# EAGLE board SparkFun_DataLogger_IoT_9DOF (EAGLE 9.6.2)
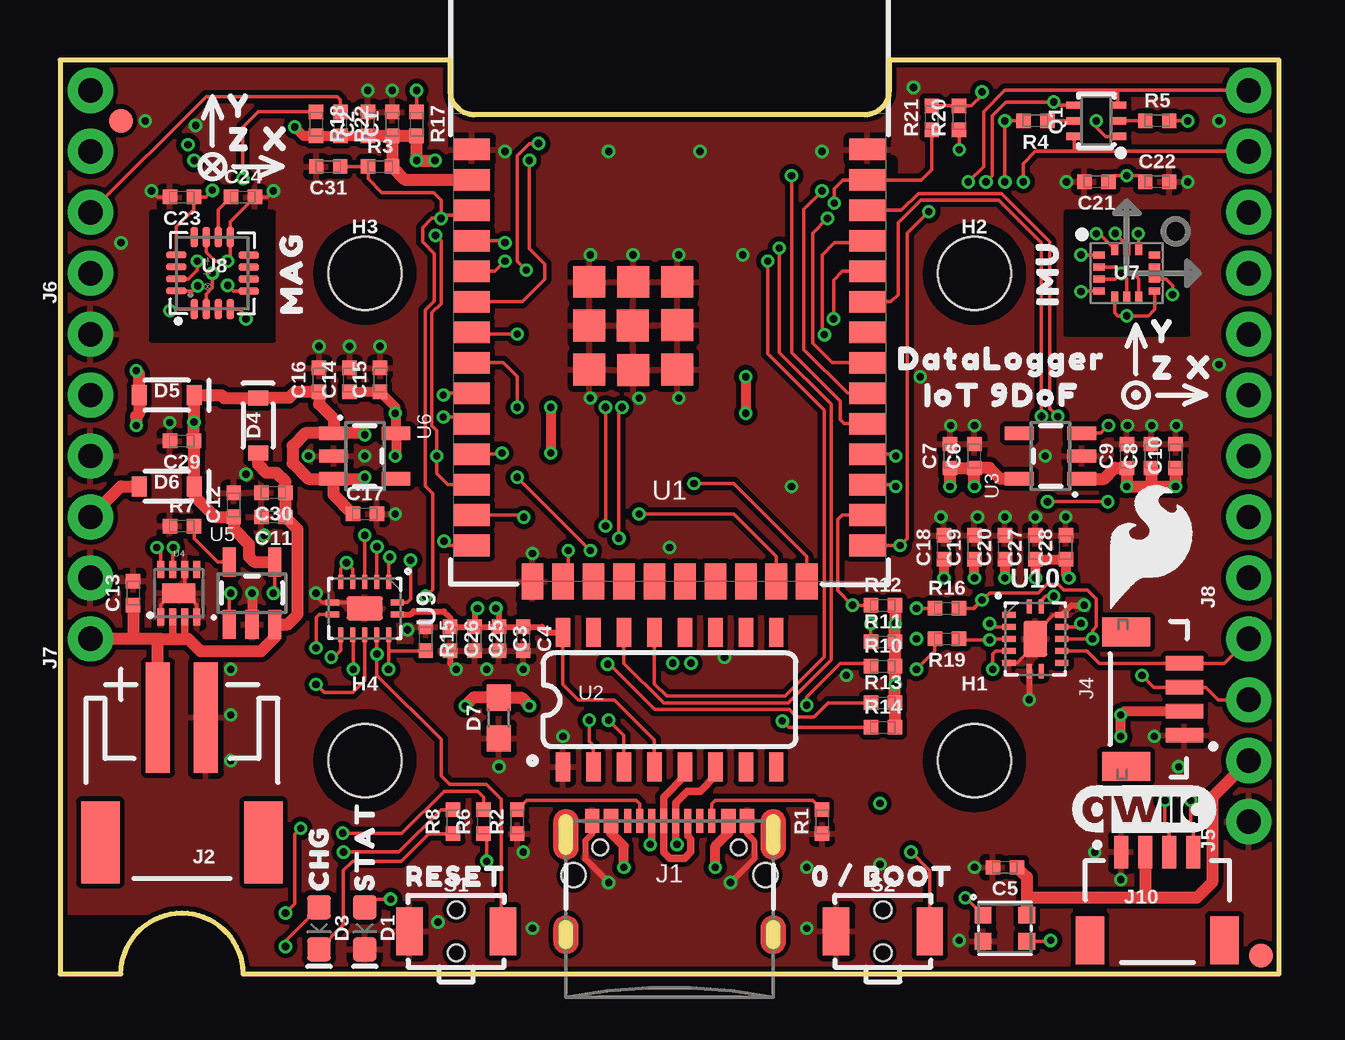
[diagram p1: board, top side]
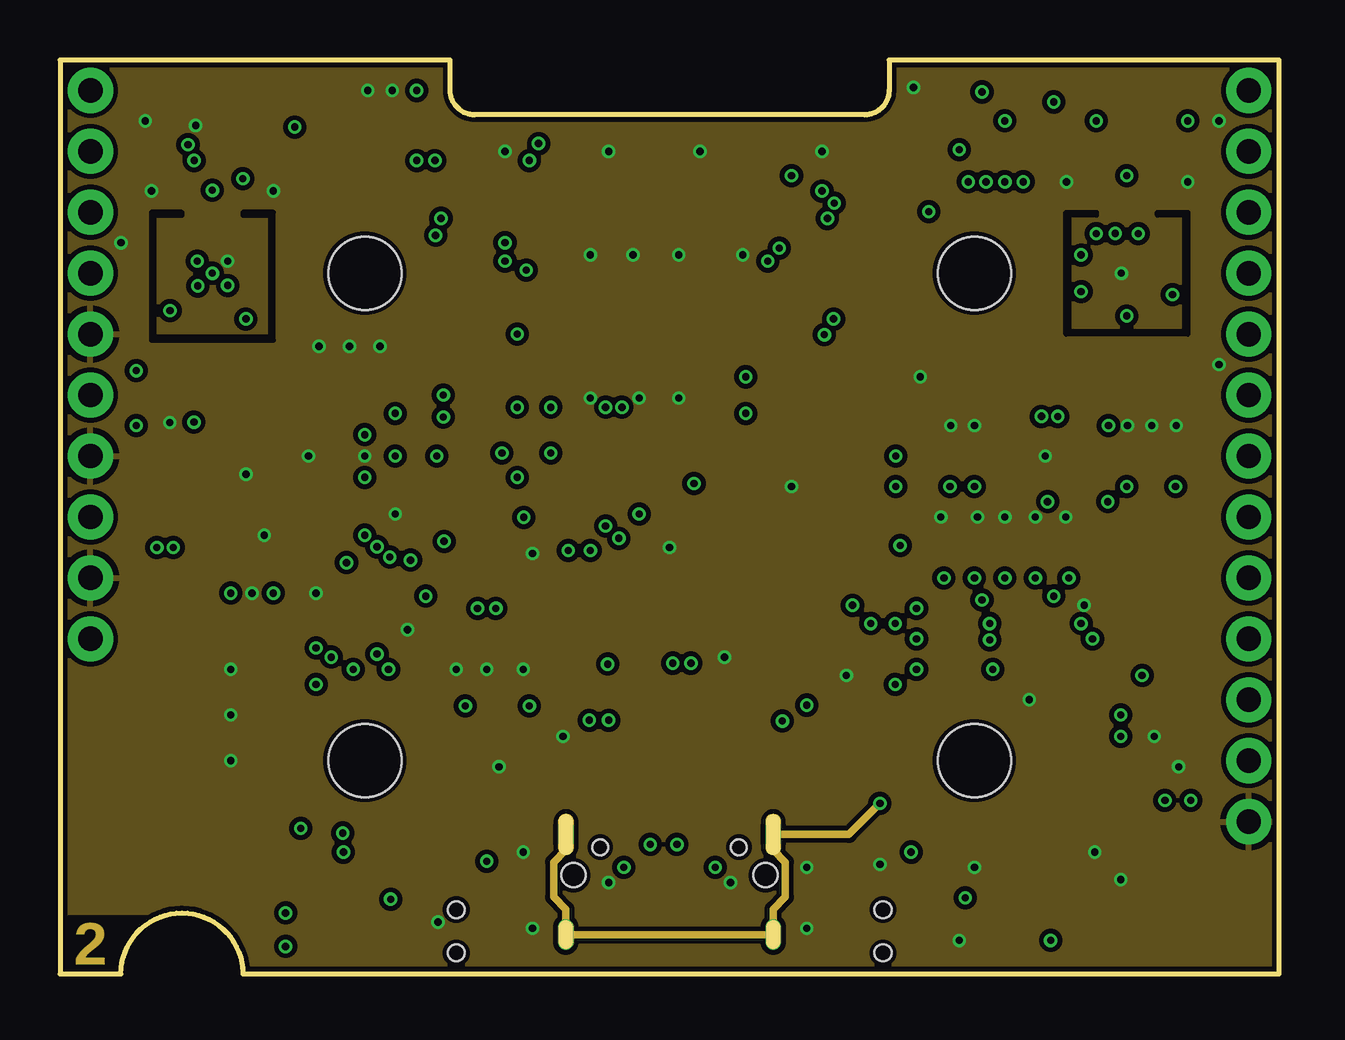
[diagram p2: board, inner layer Route2]
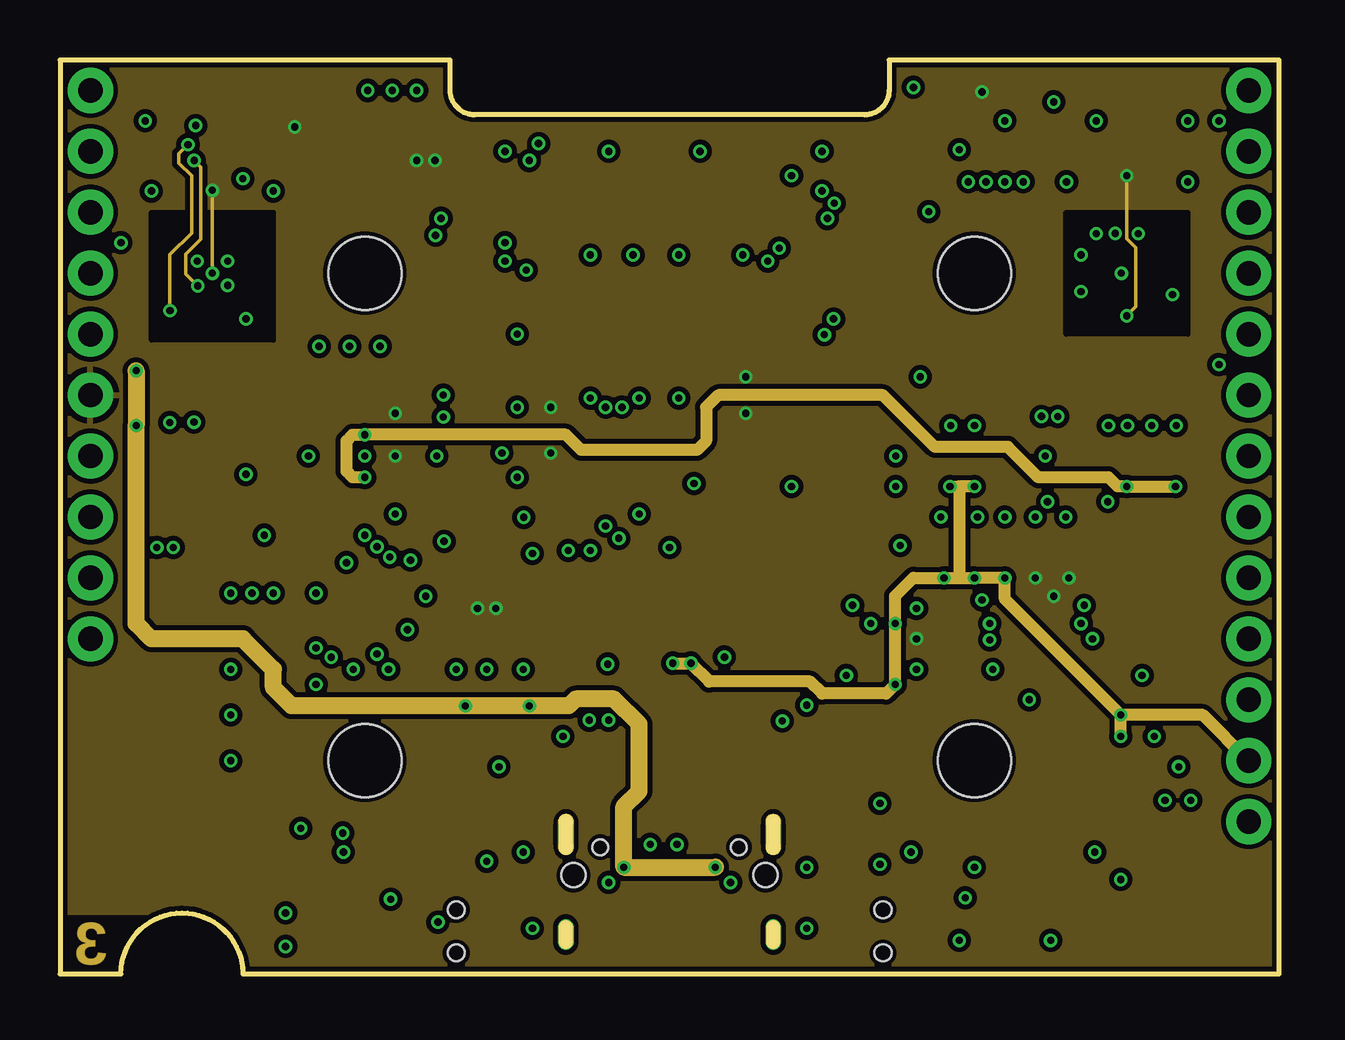
[diagram p3: board, inner layer Route15]
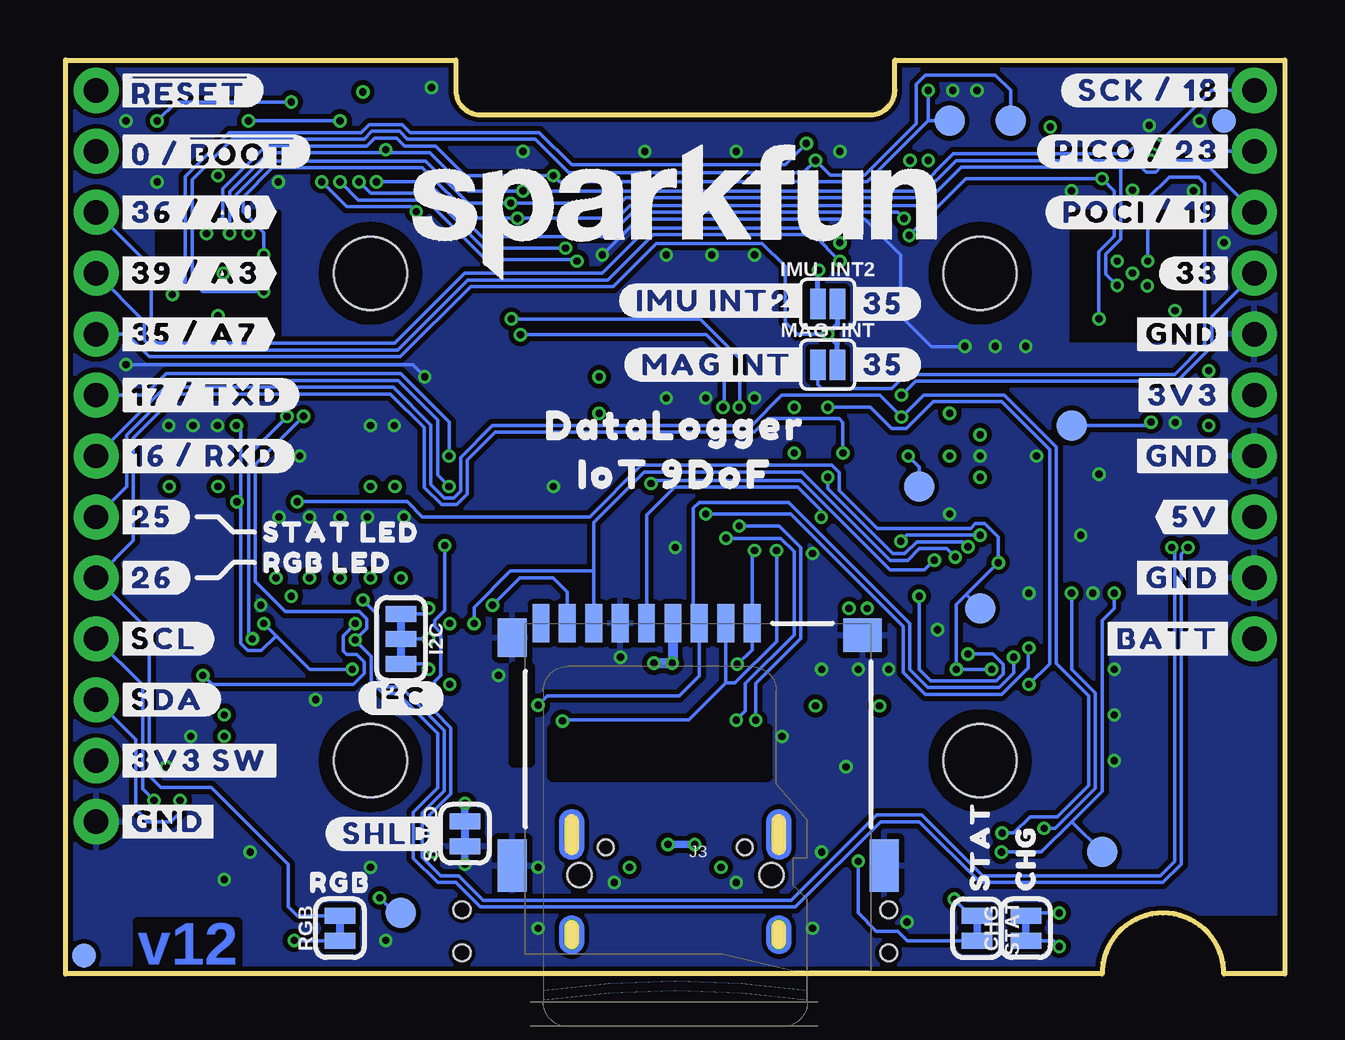
[diagram p4: board, bottom side, seen from below]

Size 50.8 x 38.1 mm. Coordinates in mm from the lower left corner, seen from the top.
Outline: 0,0 2.54,0 arc-90 5.08,2.54 arc-90 7.62,0 50.8,0 50.8,38.1 34.54,38.1 34.54,36.83 arc-90 33.53,35.81 17.27,35.81 arc-90 16.26,36.83 16.26,38.1 0,38.1 0,0
Copper layers (1*2*15*16): Top 0.035559375mm / dielectric 0.47751875mm / Route2 0.035559375mm / dielectric 0.47751875mm / Route15 0.035559375mm / dielectric 0.47751875mm / Bottom 0.035559375mm
Design rules "SparkFun-4-Layer-Minimum-JLCPCB": minimum track width 5mil, minimum drill 0.2mm, track to track 5mil, track to pad 5mil, pad to pad 5mil, via to via 5mil, smd to smd 5mil, copper to edge 7mil, drill to drill 7mil, minimum pad ring 5mil, minimum via ring 5mil, stop-mask expansion 2.5mil, vias tented up to drill 25mil, thermal gap 10mil
tRestrict: 2 lines

## Footprints (pad centres in the part's own frame; a part is rotated, then mirrored left to right if it is on the bottom)
0402-TIGHT = smd 0.6 x 0.6: 1 -0.5,0; 2 0.5,0
0402-TIGHT_NO_CREAM = smd 0.6 x 0.6: 1 -0.5,0; 2 0.5,0
SMT-JUMPER_2_NC_TRACE_SILK = smd 0.66 x 1.27: 1 -0.521,0; 2 0.521,0
LED-0603 = smd 1 x 1: A -0.877,0; C 0.877,0
WS2812-2020 = smd 0.7 x 0.7: DI -0.915,0.55; DO 0.915,-0.55; GND 0.915,0.55; VCC -0.915,-0.55
SOD-323 = smd 0.63 x 0.83: A 1.15,0; C -1.15,0
0603 = smd 1.1 x 1: 1 -0.85,0; 2 0.85,0
FIDUCIAL-1X2 = smd 1 x 1: 1 0,0
STAND-OFF-TIGHT = hole 3.048: 0,0
SMT-JUMPER_3_2-NC_TRACE_SILK = smd 0.66 x 1.27: 1 -1.041,0; 2 0,0; 3 1.041,0
PAD.03X.05 = smd 1.27 x 1.27: 1 0,0
SMT-JUMPER_2_NO_SILK = smd 0.635 x 1.27: 1 -0.406,0; 2 0.406,0
USB-C-16P_4LAYER-PADS = smd 0.3 x 1: A5 -1.25,-0.34; A6 -0.25,-0.34; A7 0.25,-0.34; A8 1.25,-0.34; B5 1.75,-0.34; B6 0.75,-0.34; B7 -0.75,-0.34; B8 -1.75,-0.34 | smd 0.6 x 1: GND -3.225,-0.34; GND2 3.225,-0.34; VBUS1 -2.45,-0.34; VBUS2 2.45,-0.34 | drill 0.4 pad 0.6 long: SHLD1 -4.318,-0.915; SHLD2 4.318,-0.915; SHLD3 -4.318,-5.095; SHLD4 4.318,-5.095 | hole 0.65: -2.89,-1.445; 2.89,-1.445
JST-2-SMD = smd 1 x 4.6: 1 -1,-3.7; 2 1,-3.7 | smd 1.6 x 3.4: NC1 -3.4,1.5; NC2 3.4,1.5
MICROSD-EXTERNALPIN = smd 0.7 x 1.6: 1 2.25,10.5; 2 1.15,10.5; 3 0.05,10.5; 4 -1.05,10.5; 5 -2.15,10.5; 6 -3.25,10.5; 7 -4.35,10.5; 8 -5.45,10.5; 9 -6.55,10.5 | smd 1.2 x 1.6: 10 -7.75,9.9 | smd 1.2 x 2.2: 11 -7.75,0.4; 12 7.75,0.4 | smd 1.6 x 1.4: 13 6.85,10 | hole 1: 3.05,0; -4.95,0
JST04_1MM_VERT = smd 0.6 x 1.55: 1 -1.478,0.775; 2 -0.478,0.775; 3 0.522,0.775; 4 1.522,0.775 | smd 1.2 x 2: NC1 -2.778,3.2; NC2 2.822,3.2
1X04_NO_SILK = drill 1.016 pad 1.88: 1 0,0; 2 2.54,0; 3 5.08,0; 4 7.62,0
1X06_NO_SILK = drill 1.016 pad 1.88: 1 0,0; 2 2.54,0; 3 5.08,0; 4 7.62,0; 5 10.16,0; 6 12.7,0
1X09_NO_SILK = drill 1.016 pad 1.88: 1 0,0; 2 2.54,0; 3 5.08,0; 4 7.62,0; 5 10.16,0; 6 12.7,0; 7 15.24,0; 8 17.78,0; 9 20.32,0
JST04_1MM_RA = smd 0.6 x 1.35: 1 -1.5,0; 2 -0.5,0; 3 0.5,0; 4 1.5,0 | smd 1.2 x 2: NC1 2.8,-3.675; NC2 -2.8,-3.675
SC70-6 = smd 0.3 x 0.66: 1 -0.65,-0.92; 2 0,-0.92; 3 0.65,-0.92; 4 0.65,0.92; 5 0,0.92; 6 -0.65,0.92
TACTILE_SWITCH_SMD_RIGHT_ANGLE = smd 1.1 x 2: 1 -1.95,0; 2 1.95,0 | hole 0.7: 0,0.9; 0,-0.9
ESP-WROOM-32D-NARROW = smd 0.9 x 1.5: 1 6.43,8.238; 2 5.16,8.238; 3 3.89,8.238; 4 2.62,8.238; 5 1.35,8.238; 6 0.08,8.238; 7 -1.19,8.238; 8 -2.46,8.238; 9 -3.73,8.238; 10 -5,8.238; 11 -6.27,8.238; 12 -7.54,8.238; 13 -8.81,8.238; 14 -10.08,8.238; 25 -10.08,-8.238; 26 -8.81,-8.238; 27 -7.54,-8.238; 28 -6.27,-8.238; 29 -5,-8.238; 30 -3.73,-8.238; 31 -2.46,-8.238; 32 -1.19,-8.238; 33 0.08,-8.238; 34 1.35,-8.238; 35 2.62,-8.238; 36 3.89,-8.238; 37 5.16,-8.238; 38 6.43,-8.238 | smd 1.5 x 0.9: 15 -11.57,5.715; 16 -11.57,4.445; 17 -11.57,3.175; 18 -11.57,1.905; 19 -11.57,0.635; 20 -11.57,-0.635; 21 -11.57,-1.905; 22 -11.57,-3.175; 23 -11.57,-4.445; 24 -11.57,-5.715 | smd 1.33 x 1.33: GND1 -0.912,1.531; GNDT1 -2.751,3.346; GNDT2 -2.761,1.516; GNDT3 -2.751,-0.314; GNDT4 -0.891,-0.324; GNDT5 0.909,-0.314; GNDT6 0.909,1.516; GNDT7 0.909,3.346; GNDT8 -0.921,3.346
SO016 = smd 0.6 x 1.2: 1 -4.445,-2.8; 2 -3.175,-2.8; 3 -1.905,-2.8; 4 -0.635,-2.8; 5 0.635,-2.8; 6 1.905,-2.8; 7 3.175,-2.8; 8 4.445,-2.8; 9 4.445,2.8; 10 3.175,2.8; 11 1.905,2.8; 12 0.635,2.8; 13 -0.635,2.8; 14 -1.905,2.8; 15 -3.175,2.8; 16 -4.445,2.8
SOT23-5 = smd 0.55 x 1.2: 1 -0.95,-1.3; 2 0,-1.3; 3 0.95,-1.3; 4 0.95,1.3; 5 -0.95,1.3
DFN-8 = smd 0.3 x 0.7: 1 -0.75,-0.99; 2 -0.25,-0.99; 3 0.25,-0.99; 4 0.75,-0.99; 5 0.75,0.99; 6 0.25,0.99; 7 -0.25,0.99; 8 -0.75,0.99 | smd 1.38 x 0.8: 9 0,0
LGA-14L = smd 0.48 x 0.3: P1 -1.163,0.75; P2 -1.163,0.25; P3 -1.163,-0.25; P4 -1.163,-0.75; P8 1.163,-0.75; P9 1.163,-0.25; P10 1.163,0.25; P11 1.163,0.75 | smd 0.3 x 0.48: P5 -0.5,-1; P6 0,-1; P7 0.5,-1; P12 0.5,1; P13 0,1; P14 -0.5,1
LGA-16-3X3MM-4X4PINS = smd 0.3 x 0.85: 1 0.754,1.498; 2 0.254,1.498; 3 -0.246,1.498; 4 -0.746,1.498; 9 -0.746,-1.506; 10 -0.246,-1.506; 11 0.254,-1.506; 12 0.754,-1.506 | smd 0.85 x 0.3: 5 -1.508,0.746; 6 -1.508,0.246; 7 -1.508,-0.254; 8 -1.508,-0.754; 13 1.496,-0.764; 14 1.496,-0.264; 15 1.496,0.236; 16 1.496,0.736
14-QFN = smd 0.25 x 0.6: 1 -0.25,1.35; 7 -0.25,-1.35; 8 0.25,-1.35; 14 0.25,1.35 | smd 0.6 x 0.25: 2 -1.1,1; 3 -1.1,0.5; 4 -1.1,0; 5 -1.1,-0.5; 6 -1.1,-1; 9 1.1,-1; 10 1.1,-0.5; 11 1.1,0; 12 1.1,0.5; 13 1.1,1 | smd 1 x 1.5: EPAD 0,0

## Placement (x,y rotation side)
C1  2.2uF  [0402-TIGHT]  13.84,35.43 90 top
C2  0.1uF  [0402-TIGHT]  12.83,35.43 90 top
C3  2.2uF  [0402-TIGHT]  18.29,13.97 270 top
C4  10nF  [0402-TIGHT]  19.3,13.97 270 top
C5  2.2uF  [0402-TIGHT]  39.37,4.45 180 top
C6  2.2uF  [0402-TIGHT]  38.1,21.59 90 top
C7  0.1uF  [0402-TIGHT]  37.08,21.59 90 top
C8  2.2uF  [0402-TIGHT]  45.47,21.59 90 top
C9  2.2uF  [0402-TIGHT]  44.45,21.59 90 top
C10  2.2uF  [0402-TIGHT]  46.48,21.59 90 top
C11  2.2uF  [0402-TIGHT]  8.89,19.05 180 top
C12  2.2uF  [0402-TIGHT]  7.24,19.56 90 top
C13  0.1uF  [0402-TIGHT]  3.05,15.88 90 top
C14  2.2uF  [0402-TIGHT]  12.06,24.77 90 top
C15  0.1uF  [0402-TIGHT]  13.34,24.77 90 top
C16  2.2uF  [0402-TIGHT]  10.79,24.77 90 top
C17  0.1uF  [0402-TIGHT]  12.7,19.18 0 top
C18  2.2uF  [0402-TIGHT]  36.83,17.78 90 top
C19  0.1uF  [0402-TIGHT]  38.1,17.78 90 top
C20  2.2uF  [0402-TIGHT]  39.37,17.78 90 top
C21  0.1uF  [0402-TIGHT]  43.18,33.02 180 top
C22  0.1uF  [0402-TIGHT]  45.72,33.02 0 top
C23  2.2uF  [0402-TIGHT]  5.08,32.38 180 top
C24  10uF  [0402-TIGHT]  7.62,32.38 0 top
C25  2.2uF  [0402-TIGHT]  17.27,13.97 270 top
C26  2.2uF  [0402-TIGHT]  16.26,13.97 270 top
C27  2.2uF  [0402-TIGHT]  40.64,17.78 90 top
C28  2.2uF  [0402-TIGHT]  41.91,17.78 90 top
C29  2.2uF  [0402-TIGHT]  5.08,22.23 180 top
C30  2.2uF  [0402-TIGHT]  8.89,20.07 180 top
C31  DNP  [0402-TIGHT_NO_CREAM]  11.18,33.66 180 top
CHG  JUMPER-SMT_2_NC_TRACE_SILK  [SMT-JUMPER_2_NC_TRACE_SILK]  10.79,1.91 90 bottom
D1  BLUE  [LED-0603]  12.7,1.91 270 top
D2  WS2812_2020  [WS2812-2020]  39.37,1.91 180 top
D3  Yellow  [LED-0603]  10.79,1.91 270 top
D4  3A/10V/280mV  [SOD-323]  8.26,22.86 270 top
D5  3A/10V/280mV  [SOD-323]  4.45,24.13 180 top
D6  3A/10V/280mV  [SOD-323]  4.45,20.32 180 top
D7  TVS  [0603]  18.29,10.67 90 top
FD1  FIDUCIAL1X2  [FIDUCIAL-1X2]  2.54,35.56 0 bottom
FD2  FIDUCIAL1X2  [FIDUCIAL-1X2]  2.54,35.56 0 top
FD3  FIDUCIAL1X2  [FIDUCIAL-1X2]  50.04,0.76 0 bottom
FD4  FIDUCIAL1X2  [FIDUCIAL-1X2]  50.04,0.76 0 top
FRAME1  FRAME-LEDGER  [CREATIVE_COMMONS]  88.9,-5.08 0 top  (outside the outline)
H1  STAND-OFFTIGHT  [STAND-OFF-TIGHT]  38.1,8.89 0 top
H2  STAND-OFFTIGHT  [STAND-OFF-TIGHT]  38.1,29.21 0 top
H3  STAND-OFFTIGHT  [STAND-OFF-TIGHT]  12.7,29.21 0 top
H4  STAND-OFFTIGHT  [STAND-OFF-TIGHT]  12.7,8.89 0 top
I2C  JUMPER-SMT_3_2-NC_TRACE_SILK  [SMT-JUMPER_3_2-NC_TRACE_SILK]  36.83,13.97 270 bottom
IMU_!CS!  TEST-POINT3X5  [PAD.03X.05]  13.97,35.56 0 bottom
IMU_INT1  TEST-POINT3X5  [PAD.03X.05]  11.43,35.56 0 bottom
IMU_INT2  JUMPER-SMT_2_NO_SILK  [SMT-JUMPER_2_NO_SILK]  19.05,27.94 0 bottom
J1  [USB-C-16P_4LAYER-PADS]  25.4,6.73 0 top
J2  [JST-2-SMD]  5.08,6.99 180 top
J3  MICRO-SD-PUSH-PUSH-EXT-PIN  [MICROSD-EXTERNALPIN]  24.45,4.11 0 bottom
J4  Vertical Qwiic Connector  [JST04_1MM_VERT]  47.62,11.43 90 top
J5  [1X04_NO_SILK]  49.53,6.35 90 top
J6  [1X04_NO_SILK]  1.27,29.21 90 top
J7  [1X06_NO_SILK]  1.27,13.97 90 top
J8  [1X09_NO_SILK]  49.53,16.51 90 top
J10  QWIIC_RIGHT_ANGLE  [JST04_1MM_RA]  45.72,5.08 0 top
LOGO1  SPECIAL_INSTRUCTIONS-ORDERING  [ORDERING_INSTRUCTIONS]  62.23,54.61 0 top  (outside the outline)
LOGO3  QWIIC_LOGO_6MM  [QWIIC_6MM]  45.21,6.86 0 top
LOGO5  SFE_LOGO_NAME.2_INCH  [SFE_LOGO_NAME_.2]  25.4,31.75 0 bottom
LOGO6  SFE_LOGO_FLAME.2_INCH  [SFE_LOGO_FLAME_.2]  45.47,17.78 0 top
MAG_!CS!  TEST-POINT3X5  [PAD.03X.05]  15.24,20.32 0 bottom
MAG_INT  JUMPER-SMT_2_NO_SILK  [SMT-JUMPER_2_NO_SILK]  19.05,25.4 0 bottom
PWREN  TEST-POINT3X5  [PAD.03X.05]  12.7,15.24 0 bottom
Q1  [SC70-6]  43.18,35.56 90 top
R1  5.1k  [0402-TIGHT]  31.75,6.35 90 top
R2  5.1k  [0402-TIGHT]  19.05,6.35 90 top
R3  10k  [0402-TIGHT]  13.34,33.66 0 top
R4  10k  [0402-TIGHT]  40.64,35.56 180 top
R5  10k  [0402-TIGHT]  45.72,35.56 0 top
R6  1k  [0402-TIGHT]  17.65,6.35 90 top
R7  2.0K  [0402-TIGHT]  5.08,18.67 0 top
R8  1k  [0402-TIGHT]  16.38,6.35 90 top
R10  10k  [0402-TIGHT]  34.29,12.83 0 top
R11  10k  [0402-TIGHT]  34.29,13.84 0 top
R12  10k  [0402-TIGHT]  34.29,15.37 0 top
R13  10k  [0402-TIGHT]  34.29,11.3 0 top
R14  10k  [0402-TIGHT]  34.29,10.29 0 top
R15  100k  [0402-TIGHT]  15.24,13.97 270 top
R16  2.2k  [0402-TIGHT]  36.96,15.24 0 top
R17  100k  [0402-TIGHT]  14.86,35.43 270 top
R18  100k  [0402-TIGHT]  10.67,35.43 270 top
R19  2.2k  [0402-TIGHT]  36.96,13.97 180 top
R20  100k  [0402-TIGHT]  37.47,35.69 90 top
R21  100k  [0402-TIGHT]  36.32,35.69 90 top
R22  10k  [0402-TIGHT]  11.68,35.43 270 top
RGB  JUMPER-SMT_2_NC_TRACE_SILK  [SMT-JUMPER_2_NC_TRACE_SILK]  39.37,1.91 90 bottom
S1  RESET  [TACTILE_SWITCH_SMD_RIGHT_ANGLE]  16.51,1.78 0 top
S2  BOOT  [TACTILE_SWITCH_SMD_RIGHT_ANGLE]  34.29,1.78 0 top
SHLD  JUMPER-SMT_2_NC_TRACE_SILK  [SMT-JUMPER_2_NC_TRACE_SILK]  34.16,5.84 90 bottom
STAT  JUMPER-SMT_2_NC_TRACE_SILK  [SMT-JUMPER_2_NC_TRACE_SILK]  12.83,1.91 270 bottom
TP1  TEST-POINT3X5  [PAD.03X.05]  36.83,2.54 180 bottom
U1  ESP-WROOM-32E  [ESP-WROOM-32D-NARROW]  25.4,27.94 90 top
U2  CH340C  [SO016]  25.4,11.43 0 top
U3  3.3V  [SOT23-5]  41.27,21.59 90 top
U4  MAX17048  [DFN-8]  4.95,15.88 0 top
U5  MCP73831  [SOT23-5]  8,15.88 0 top
U6  3.3V  [SOT23-5]  12.7,21.59 270 top
U7  ISM330DHCX  [LGA-14L]  44.45,29.21 0 top
U8  MMC5983MA_QFN16  [LGA-16-3X3MM-4X4PINS]  6.35,29.21 180 top
U9  74HC4066_QUAD_BILATERAL_SWITCH_QFN  [14-QFN]  12.7,15.24 270 top
U10  74HC4066_QUAD_BILATERAL_SWITCH_QFN  [14-QFN]  40.64,13.97 0 top
U$1  [IOT_9DOF0]  39.24,24.13 0 top
U$2  [RESET0]  16.51,4.06 0 top
U$3  [STAT0]  12.7,5.33 90 top
U$4  [CHG0]  10.79,4.83 90 top
U$5  [CHG0]  10.79,4.83 90 bottom
U$6  [STAT0]  12.7,5.33 90 bottom
U$7  [0_#_BOOT0]  34.29,4.06 0 top
U$8  [IMU0]  41.15,29.21 90 top
U$9  [MAG0]  9.65,29.21 90 top
U$10  [X0]  9.02,34.8 0 top
U$11  [Y0]  7.49,36.2 0 top
U$12  [Z0]  7.49,34.8 0 top
U$13  [X0]  47.5,25.27 0 top
U$14  [Y0]  45.97,26.8 0 top
U$15  [Z0]  45.97,25.27 0 top
U$16  [##RESET##0]  48.77,36.83 0 bottom
U$17  [#0_#_#BOOT##0]  48.77,34.29 0 bottom
U$18  [#36_#_A0#0]  48.77,31.75 0 bottom
U$19  [#39_#_A3#0]  48.77,29.21 0 bottom
U$20  [#35_#_A7#0]  48.77,26.67 0 bottom
U$21  [#17_#_TXD#0]  48.77,24.13 0 bottom
U$22  [#16_#_RXD#0]  48.77,21.59 0 bottom
U$23  [#25#0]  48.77,19.05 0 bottom
U$24  [#26#0]  48.77,16.51 0 bottom
U$25  [#SCL#0]  48.77,13.97 0 bottom
U$26  [#SDA#0]  48.77,11.43 0 bottom
U$27  [#3V3_SW#0]  48.77,8.89 0 bottom
U$28  [#GND#0]  48.77,6.35 0 bottom
U$29  [#GND#1]  2.03,16.51 0 bottom
U$30  [#GND#1]  2.03,21.59 0 bottom
U$31  [#GND#1]  2.03,26.67 0 bottom
U$32  [#BATT#0]  2.03,13.97 0 bottom
U$33  [#5V#0]  2.03,19.05 0 bottom
U$34  [#3V3#0]  2.03,24.13 0 bottom
U$35  [#33#0]  2.03,29.21 0 bottom
U$36  [#POCI_#_19#0]  2.03,31.75 0 bottom
U$37  [#PICO_#_23#0]  2.03,34.29 0 bottom
U$38  [#SCK_#_18#0]  2.03,36.83 0 bottom
U$40  [#IMU_INT2#0]  19.81,28.07 0 bottom
U$41  [#MAG_INT#0]  19.81,25.4 0 bottom
U$42  [#35#0]  18.29,27.94 0 bottom
U$43  [#35#0]  18.29,25.4 0 bottom
U$44  [IOT_9DOF10]  25.4,20.83 0 bottom
U$45  [#SHLD#0]  34.8,5.84 0 bottom
U$46  [#I�C#0]  36.83,11.49 0 bottom
U$47  [STAT_LED0]  43.18,18.41 0 bottom
U$48  [RGB_LED0]  43.18,17.14 0 bottom
U$49  [RGB0]  39.37,3.81 0 bottom
U$50  [DATALOGGER0]  39.24,25.65 0 top
U$51  [DATALOGGER1]  25.4,22.86 0 bottom
VIN  TEST-POINT3X5  [PAD.03X.05]  8.89,22.86 0 bottom
VIN1  TEST-POINT3X5  [PAD.03X.05]  7.62,5.08 0 bottom

## Tracks (layer width: path | path; a pad name or v marks a point on that pad's centre or on a via)
3.3V  (via drill 0.3)
  Top 0.152: C21.1 43.93,33.27 v44.45,33.27 44.97,33.27 C22.1 | U7.P5 43.94,27.56 44.07,27.43 v44.45,27.43 45.34,27.43 45.61,27.71 U7.P8 | v6.35,32.67 6.07,32.38 C23.1 5.58,31.87 4.85,31.14 U8.13 | v6.35,29.21 6.35,28.6 6.1,28.35 U8.2 | U10.14 40.89,15.57 41.06,15.75 v41.4,15.75 | U2.4 24.77,9.75 23.09,11.43 21.59,11.43 20.95,12.06 U2.16 | v38.42,36.77 38.42,36.64 37.97,36.19 R20.2 R21.2
  Top 0.254: U9.14 14.61,14.99 14.73,15.11 15.99,15.11 16.26,14.85 C26.1 C25.1 | v17.4,15.24 17.27,15.11 C25.1 | C25.1 C3.1 | U2.16 20.31,14.23 20.07,14.47 C4.1 C3.1 | v18.16,15.24 18.29,15.11 C3.1
  Top 0.406: v13.97,21.59 14,21.62 U6.5 14,23.34 v13.97,23.37 13.97,23.63 C15.1 C14.1 | v42.04,16.51 v42.04,16.52 41.91,16.64 C28.1 C27.1 v40.64,16.51 | v20.45,23.62 v20.45,21.72 | v28.57,24.89 v28.57,23.37 | C2.1 R22.2 R18.2 10.15,34.93 v9.78,35.31 | R3.2
  Top 0.508: C1.1 C2.1 | U1.2 14.39,33.1 R3.2 | C1.1 R3.2 | C1.1 R17.2 v14.86,33.91 v15.62,33.91
  Route15 0.152: v6.35,32.67 v6.35,29.21 | v44.45,33.27 44.45,30.66 44.83,30.28 44.83,27.81 v44.45,27.43
  Bottom 0.152: I2C.2 v35.69,13.97
  pour Route15 (isolate 0.203): 3.81,0 3.81,2.54 0,2.54 0,38.1 16.26,38.1 16.26,35.81 34.54,35.81 34.54,38.1 50.8,38.1 50.8,0
  cutout Route15: 3.81,26.42 3.81,31.75 8.89,31.75 8.89,26.42
  cutout Route15: 41.91,26.67 41.91,31.75 46.99,31.75 46.99,26.67
3.3V_SW  (via drill 0.3)
  Top 0.406: C18.1 v36.83,16.51 | v38.1,16.51 C19.1 | C20.1 v39.37,16.51 | 34.79,14.6 v34.8,14.61 | 34.79,12.07 v34.8,12.06 | J4.2 44.35,10.95 v44.2,10.79 v44.2,9.91 | 45.22,3.18 45.21,3.17
  Top 0.508: 34.79,14.6 R11.2 R10.2 34.79,12.07 R13.2 R14.2 | R12.2 v34.8,14.61 | J5.2 48.01,7.37 48.01,3.81 47.37,3.17 45.21,3.17 40.28,3.17 | C6.1 C7.1 v37.08,20.32 | v38.1,20.32 C6.1 | U3.5 39.18,20.64 38.73,21.09 C6.1 | J10.2 45.22,3.18 | 40.28,3.17 D2.VCC | C5.1 40.28,4.03 40.28,3.17
  Route15 0.508: 37.47,16.51 v36.83,16.51 35.56,16.51 34.8,15.75 v34.8,14.61 v34.8,12.06 34.42,11.68 31.75,11.68 31.24,12.19 27.05,12.19 v26.29,12.95 v25.53,12.95 | 37.47,16.51 v38.1,16.51 v39.37,16.51 39.37,15.62 v44.2,10.79 | J5.2 47.62,10.79 v44.2,10.79 | v37.08,20.32 37.47,20.32 | 37.47,20.32 37.47,16.51 | v38.1,20.32 37.47,20.32 | v44.2,9.91 v44.2,10.79
  Bottom 0.406: J3.4 25.5,12.98 v25.53,12.95 v26.29,12.95
5V
  Top 0.508: J7.3 2.54,20.32 D6.A
!RESET!  (via drill 0.3)
  Top 0.152: U9.12 v13.2,13.34 v13.21,13.34 13.21,12.45 15.88,9.78 15.88,8.26 16.23,7.9 17.75,7.9 18.39,7.27 18.39,1.85 S1.2 | v37.85,33.02 38.48,33.66 38.48,35.94 39.37,36.83 44.07,36.83 | 44.07,36.83 J8.9 | Q1.3 44.07,36.24 44.07,36.83 | U1.3 16.95,31.62 16,31.62 v15.88,31.5 | v15.24,15.75 15.52,16.03 15.52,20.02 15.21,20.33 15.21,27.68 15.6,28.06 15.6,30.04 15.11,30.52 15.11,31.11 15.49,31.5 v15.88,31.5 | v15.88,31.5 15.88,32.26 15.57,32.57 13.41,32.57 12.84,33.15 R3.1 C31.1
  Bottom 0.152: v37.85,33.02 35.74,33.02 33.46,30.73 28.19,30.73 27.18,31.75 16.13,31.75 v15.88,31.5 | v13.21,13.34 12.18,13.34 11.74,12.9 11.74,12.5 12.02,12.22 14.76,12.22 15.24,12.7 v15.24,15.75
CAP
  Top 0.152: U8.10 6.6,31.87 C24.1
CH340-DTR  (via drill 0.3)
  Top 0.152: R4.2 v39.37,35.56 v39.37,33.02 | Q1.1 43.58,34.91 43.18,35.31 v43.18,35.56 | U2.13 24.77,12.09 25.27,11.58 30.23,11.58 31.85,13.21 31.85,23.51 29.49,25.87 v29.49,29.72
  Bottom 0.152: v39.37,35.56 v43.18,35.56 | v29.49,29.72 29.55,29.77 33.29,29.77 35.77,32.26 38.61,32.26 v39.37,33.02
CH340-RTS  (via drill 0.3)
  Top 0.152: R5.2 v46.99,35.56 | Q1.4 41.62,36.21 41.48,36.35 v41.4,36.35 39.41,36.35 38.83,35.77 38.83,33.27 v38.58,33.02 | v29.97,30.25 29.97,25.91 32.13,23.75 32.13,13.08 30.35,11.3 25.15,11.3 23.5,12.95 U2.14
  Bottom 0.152: v46.99,35.56 46.2,36.35 v41.4,36.35 | v38.58,33.02 38.1,32.54 35.66,32.54 33.37,30.25 v29.97,30.25
CH340-RX  (via drill 0.3)
  Top 0.152: U1.35 33.56,30.48 32.26,30.48 31.75,29.97 31.75,26.75 v31.85,26.65 | v22.86,10.58 23.5,9.94 U2.3 | v23.41,23.62 23.29,23.5 v23.29,18.16
  Bottom 0.152: v31.85,26.65 24.11,26.65 23.37,25.91 23.37,23.67 v23.41,23.62 | v23.29,18.16 21,18.16 20.45,17.61 20.45,14.13 22.48,12.1 22.48,10.96 v22.86,10.58
CH340-TX  (via drill 0.3)
  Top 0.152: U1.34 32.59,29.29 32.23,28.93 v32.23,27.3 | v22.05,10.58 22.05,9.69 22.23,9.52 U2.2 | v22.73,23.62 v22.73,18.67
  Bottom 0.152: v32.23,27.3 24.37,27.3 22.71,25.64 22.71,23.65 v22.73,23.62 | v22.05,10.58 22.05,12.1 20.17,13.98 20.17,17.77 21.07,18.67 v22.73,18.67
D+
  Top 0.305: U2.5 26.04,8.26 25.15,7.37 J1.A6 25.15,5.08 25.4,4.83 26.04,4.83 26.29,5.08 26.29,5.62 26.15,5.76 J1.B6
D-  (via drill 0.3)
  Top 0.305: U2.6 27.3,8.26 26.67,7.62 26.14,7.62 25.65,7.13 J1.A7 25.65,5.4 v25.71,5.4 | J1.B7 24.65,5.5 24.59,5.45 v24.59,5.4
  Bottom 0.305: v25.71,5.4 v24.59,5.4
ESP0/!BOOT!  (via drill 0.3)
  Top 0.152: J8.8 42.29,34.29 | Q1.6 42.26,34.32 42.29,34.29 | v40.13,33.02 40.13,33.78 40.64,34.29 42.29,34.29 | U1.25 v35.01,17.86 35.31,18.16 35.31,30.89 v36.2,31.78 | S2.2 36.24,4.3 v35.46,5.08
  Bottom 0.152: v40.13,33.02 39.09,31.98 36.4,31.98 v36.2,31.78 | v35.46,5.08 35.66,5.28 35.66,6.6 34.75,7.52 34.75,10.26 35.43,10.95 35.43,12.19 35.18,12.45 35.18,14.22 35.43,14.48 35.43,14.73 35.01,15.16 v35.01,17.86
ESP2/DAT0  (via drill 0.3)
  Top 0.152: U9.1 14.47,15.49 14.61,15.62 v14.61,17.25 | U1.24 31.11,17.4 28.07,20.45 v26.42,20.45
  Bottom 0.152: v26.42,20.45 26.29,20.57 20.18,20.57 16.44,16.84 15.02,16.84 v14.61,17.25
ESP4/DAT1  (via drill 0.3)
  Top 0.152: U1.26 32.59,19.13 32.41,18.95 32.41,15.98 v33.02,15.37 R12.1
  Bottom 0.152: J3.8 29.9,15.93 30.48,16.51 31.88,16.51 v33.02,15.37
ESP5/!IMU_CS!  (via drill 0.3)
  Top 0.152: U7.P12 44.95,30.84 v44.93,30.86 | v30.48,33.27 30.48,25.91 32.51,23.88 32.51,23.11 32.69,22.94 U1.29 | R17.1 v14.86,36.83
  Bottom 0.152: v44.93,30.86 44.25,31.54 44.25,32.73 42.46,34.52 38.26,34.52 37.93,34.84 37,34.84 36.67,34.52 35.39,34.52 34.15,33.27 v30.48,33.27 30.23,33.02 17.4,33.02 14.86,35.56 | 14.86,35.56 v14.86,36.83 | IMU_!CS!.1 14.86,35.56
ESP12/DAT2  (via drill 0.3)
  Top 0.152: U9.4 v12.7,18.29 | v16,18.03 16.18,17.86 U1.14
  Bottom 0.152: v16,18.03 15.75,18.29 v12.7,18.29
ESP13/DAT3  (via drill 0.3)
  Top 0.152: U1.16 21.18,16.6 v21.18,17.65 | R14.1 30.36,10.29 v30.1,10.54
  Bottom 0.152: J3.2 23.3,12.14 | v21.18,17.65 21.18,13.87 22.92,12.14 23.3,12.14 | v30.1,10.54 30.05,10.6 24.84,10.6 23.3,12.14
ESP14/CLK  (via drill 0.3)
  Top 0.152: U1.13 19.22,19.13 v19.32,19.04
  Bottom 0.152: v19.32,19.04 19.32,19.32 20.3,20.3 25.43,20.3 26.6,19.12 J3.5
ESP15/CMD  (via drill 0.3)
  Top 0.152: U9.8 10.8,14.99 10.67,14.86 v10.67,13.59 | v24.13,19.18 28.07,19.18 29.84,17.4 U1.23
  Bottom 0.152: v10.67,13.59 10.7,13.56 10.7,12.76 11.79,11.66 14.99,11.66 15.9,12.57 15.9,14.49 20.59,19.18 v24.13,19.18
ESP16/RXD  (via drill 0.3)
  Top 0.152: U1.27 34.75,20.4 v34.83,20.32
  Bottom 0.152: v34.83,20.32 35.31,20.8 35.31,23.1 36.95,24.74 46.38,24.74 J8.3
ESP17/TXD  (via drill 0.3)
  Top 0.152: U1.28 34.75,21.67 v34.83,21.59
  Bottom 0.152: v34.83,21.59 34.83,23.02 36.83,25.02 46.61,25.02 47.5,24.13 J8.4
ESP18/SCK  (via drill 0.3)
  Top 0.152: U8.1 4.64,27.71 v4.58,27.65 | U7.P13 44.45,30.39 v43.97,30.87 | U1.30 32.81,24.21 30.99,26.04 30.99,31.88 v31.75,32.64 | R20.1 v37.47,34.36
  Route15 0.152: v4.58,27.65 4.58,29.98 5.49,30.89 5.49,33.27 4.95,33.81 4.95,34.19 v5.33,34.57
  Bottom 0.152: v43.97,30.87 43.97,32.61 42.34,34.24 37.59,34.24 v37.47,34.36 37.34,34.24 35.63,34.24 34.04,32.64 v31.75,32.64 15.37,32.64 13.82,34.19 6.58,34.19 6.2,34.57 v5.33,34.57 5.31,34.57 3.05,36.83 J6.4
ESP19/POCI  (via drill 0.3)
  Top 0.152: U7.P1 v42.56,29.96 v42.55,29.97 | U1.31 32.18,25.48 31.37,26.29 31.37,30.89 v31.98,31.5 | U8.5 7.22,28.46 v6.99,28.7 | J6.2 6.1,36.58 11.55,36.58 11.68,36.44 R22.1
  Bottom 0.152: v42.55,29.97 42.55,30.91 43.41,31.77 43.41,32.38 42.19,33.6 35.93,33.6 33.83,31.5 v31.98,31.5 27.83,31.5 27.29,32.03 15.09,32.03 13.49,33.63 6.86,33.63 | v6.99,28.7 7.46,29.18 7.46,30 6.83,30.64 6.83,33.6 6.86,33.63 | 6.86,33.63 5.99,33.63 5.79,33.43 5.39,33.43 5.19,33.63 3.15,33.63 J6.2
ESP21/SDA  (via drill 0.3)
  Top 0.152: U1.33 34.62,28.02 34.92,28.32 34.92,31.31 35.87,32.26 39.12,32.26 40.89,30.48 v40.89,23.24 | U10.4 38.78,13.97 v38.73,13.92 37.5,13.92 R19.1 | v4.04,17.78 4.2,17.61 U4.8
  Bottom 0.152: v40.89,23.24 42.9,21.24 42.9,16.36 41.66,15.11 38.56,15.11 38.26,14.8 38.26,14.4 v38.73,13.92 38.73,13.9 38.08,13.24 38.08,12.19 37.57,11.68 36.96,11.68 35.31,10.03 35.31,7.75 36.32,6.73 36.32,4.83 35.31,3.81 34.54,3.81 33.53,2.79 20.41,2.79 16.85,6.35 15.24,6.35 12.7,3.81 5.08,3.81 4.32,4.57 4.32,17.5 v4.04,17.78 | v40.89,23.24
ESP22/SCL  (via drill 0.3)
  Top 0.152: U1.36 35.05,31.83 35.75,32.54 39.23,32.54 41.25,30.52 41.25,23.57 v41.58,23.24 | U10.11 v43.02,13.97 43.02,14.32 43.18,14.48 43.18,15.62 42.8,16 41.83,16 41.6,16.23 41.12,16.23 40.77,15.88 38.73,15.88 38.1,15.24 | 38.1,15.24 R16.2 | 38.1,15.24 38.1,15.28 v38.42,15.59 | v4.72,17.78 4.7,17.77 U4.7
  Bottom 0.152: v41.58,23.24 43.18,21.64 43.18,14.13 v43.02,13.97 | v38.42,15.59 37.8,14.97 37.8,12.31 37.45,11.96 36.84,11.96 35.03,10.15 35.03,7.63 35.94,6.72 35.94,4.85 35.18,4.09 34.43,4.09 33.41,3.07 20.56,3.07 17.01,6.63 15.12,6.63 12.58,4.09 5.2,4.09 4.6,4.69 4.6,17.66 v4.72,17.78
ESP23/PICO  (via drill 0.3)
  Top 0.152: U7.P14 43.3,30.86 v43.18,30.86 | v32.26,32.13 32.26,32.74 32.62,33.1 U1.37 35.89,33.1 36.32,33.54 R21.1 | U8.16 5.53,28.47 v5.74,28.68
  Route15 0.152: v5.74,28.68 5.24,29.18 5.24,30 5.87,30.64 5.87,33.63 v5.59,33.91
  Bottom 0.152: v43.18,30.86 43.69,31.37 43.69,32.49 42.3,33.88 35.79,33.88 34.04,32.13 v32.26,32.13 27.69,32.13 27.46,32.36 15.25,32.36 13.7,33.91 v5.59,33.91 2.92,33.91 2.54,34.29 J6.3
ESP25/LED  (via drill 0.3)
  Top 0.152: v15.97,23.21 16.89,23.21 U1.10 | R6.2 17.65,7.37 17.4,7.62 16,7.62 14.25,5.87 v11.79,5.87 v11.78,5.87
  Bottom 0.152: v11.78,5.87 11.29,5.87 10.61,6.55 9.48,6.55 8.18,7.85 8.18,11.59 9.53,12.94 9.53,21.97 11.68,24.13 15.06,24.13 v15.97,23.21 16.89,24.13 20.95,24.13 22.23,22.86 33.02,22.86 34.35,21.53 34.35,20.12 34.63,19.84 35.02,19.84 35.59,20.4 35.59,22.89 37.16,24.46 46.27,24.46 48.26,22.46 48.26,20.32 J8.2
ESP26/RGBLED  (via drill 0.3)
  Top 0.152: v18.41,21.72 18.37,21.67 U1.11
  Bottom 0.152: v18.41,21.72 18.41,22.99 18.57,23.14 21.55,23.14 22.11,22.58 32.9,22.58 34.07,21.42 34.07,20 34.51,19.56 35.14,19.56 35.87,20.29 35.87,22.77 37.28,24.18 46.15,24.18 47.98,22.35 47.98,18.06 J8.1 47.32,14.3 47.32,8.26 46.85,7.78 44.74,7.78 41.53,4.57 41.53,2.79 41.16,2.43 RGB.2
ESP27/!MAG_CS!  (via drill 0.3)
  Top 0.152: U8.4 7.47,27.71 7.75,27.43 v7.75,27.3 | U1.12 16.16,20.4 15.7,20.86 v15.7,21.59 15.7,22.66 15.49,22.86 15.49,27.56 15.88,27.94 15.88,30.56 v15.65,30.79 | R18.1 10.66,35.94 8.26,35.94 7.62,35.31 v7.62,33.15
  Bottom 0.152: v7.75,27.3 7.75,30.11 7.11,30.75 7.11,32.64 v7.62,33.15 13.29,33.15 v15.65,30.79 | v15.7,21.59 15.24,21.14 MAG_!CS!.1
ESP32/PWREN  (via drill 0.3)
  Top 0.152: U1.8 18.46,25.48 19.05,24.89 v19.05,23.62 | U9.11 12.7,12.23 12.19,11.73 11.01,11.73 v10.67,12.06
  Bottom 0.152: v19.05,23.62 17.27,23.62 16.38,22.73 15.78,22.73 14.66,23.85 11.8,23.85 9.8,21.86 9.8,12.93 v10.67,12.06
ESP33  (via drill 0.3)
  Top 0.152: U1.9 16.05,24.21 v15.97,24.13
  Bottom 0.152: v15.97,24.13 15.39,24.71 4.48,24.71 3.05,26.15 3.05,27.4 1.27,29.18 J6.1
ESP34/IMU_INT1  (via drill 0.3)
  Top 0.152: U7.P4 v42.56,28.46 v42.55,28.45 | v19.56,33.91 19.56,30.23 20.19,29.59 20.19,28.96 19.26,28.02 U1.6
  Bottom 0.152: v42.55,28.45 45.09,28.45 45.54,28.9 45.54,33.12 43.86,34.8 38.37,34.8 38.04,35.12 36.89,35.12 36.56,34.8 31.24,34.8 29.84,33.4 20.07,33.4 v19.56,33.91 18.95,33.3 17.52,33.3 15.37,35.45 15.37,37.08 14.99,37.47 12.06,37.47 11.43,36.83 IMU_INT1.1
ESP35/A7  (via drill 0.3)
  Top 0.152: v19.05,26.67 17.24,26.67 U1.7
  Bottom 0.152: v19.05,26.67 20.32,26.67 20.83,27.18 20.83,29.51 21.77,30.45 26.19,30.45 27.99,28.65 33.93,28.65 36.85,25.73 47.32,25.73 48.26,26.67 J8.5
  Bottom 0.203: IMU_INT2.2 18.64,27.08 v19.05,26.67 18.64,26.26 MAG_INT.2
ESP36/A0  (via drill 0.3)
  Top 0.152: v18.54,30.48 18.46,30.56 U1.4
  Bottom 0.152: J8.7 47.24,29.46 47.24,26.54 46.99,26.29 37.08,26.29 34.16,29.21 28.45,29.21 26.57,31.09 19.15,31.09 v18.54,30.48
ESP39/A3  (via drill 0.3)
  Top 0.152: U1.5 18.11,29.29 v18.54,29.72
  Bottom 0.152: J8.6 47.52,27.2 47.52,26.43 47.11,26.01 36.97,26.01 34.05,28.93 28.2,28.93 26.33,30.81 19.63,30.81 v18.54,29.72
GND  (via drill 0.3)
  Top 0.152: U4.6 5.2,16.12 U4.9 | U4.1 4.2,15.38 4.7,15.88 U4.9 | U4.4 5.7,15.38 5.21,15.88 U4.9 | U7.P3 43.97,28.96 v44.22,29.21 | U7.P2 43.97,29.46 v44.22,29.21 | v8.89,32.64 8.64,32.38 C24.2 7.1,31.36 U8.9 7.1,29.83 v6.99,29.72 6.48,29.72 6.1,30.1 U8.11 | C23.2 4.06,32.38 v3.81,32.64 | U9.EPAD 12.45,15.49 U9.7 10.93,15.49 10.67,15.75 v10.67,15.88 | U7.P7 44.95,28.96 44.7,29.21 v44.22,29.21 | U7.P6 44.45,28.98 v44.22,29.21 | U10.6 39.89,12.97 40.64,13.72 U10.EPAD 40.64,14.22 41.39,14.97 U10.13
  Top 0.254: J1.GND2 28.62,5.84 28.92,5.55 28.92,4.79 v27.94,3.81 | J1.GND 22.18,5.84 21.88,5.55 21.88,4.79 v22.86,3.81 | C26.2 16.26,12.95 v16.51,12.7 | U10.7 v40.39,11.43 | U10.13 42.14,15.37 v42.67,15.37
  Top 0.406: v8,15.88 U5.2
  Bottom 0.152: v28.45,29.97 26.95,31.47 17.5,31.47 16,29.97 16,27.43 14.73,26.16 v13.34,26.16 | v48.29,25.4 36.35,25.4 v35.84,24.89
  Bottom 0.305: SHLD.1 v34.16,4.57
  other vias: 31.11,1.91 31.11,4.45 37.47,1.4 7.11,12.7 7.11,8.89 7.11,10.79 15.75,2.16 18.54,34.29 12.83,36.83 13.84,36.83 19.3,5.08 19.3,12.7 20.95,9.91 12.7,21.59 13.97,19.18 12.06,26.16 10.79,26.16 41.94,33.02 46.99,33.02 31.75,34.29 22.1,29.97 25.78,29.97 25.78,24 22.1,24 23.88,29.97 24.13,24 45.49,22.86 44.48,22.86 46.51,22.86 41.05,21.59 39.37,19.05 40.64,19.05 41.91,19.05 36.7,19.05 38.23,19.05 2.54,30.48 17.78,12.7 10.35,21.59 7.75,20.83 43.12,5.08 44.2,3.94 45.59,9.91 46.61,8.64 37.11,22.86 38.1,22.86 38.1,4.45 19.68,17.53 27.69,13.21 32.77,12.45 30.48,20.32 48.29,35.56 3.56,35.56 25.4,17.78 19.68,1.91 18.29,8.64 4.57,22.99 14.48,14.35 5.65,35.37 35.56,36.96 8.51,18.29 22.86,34.29 26.67,34.29
  pour Top (isolate 0.203): 3.81,0 3.81,2.54 0,2.54 0,38.1 16.26,38.1 16.26,35.81 34.54,35.81 34.54,38.1 50.8,38.1 50.8,0
  pour Bottom (isolate 0.203): 3.81,0 3.81,2.54 0,2.54 0,38.1 16.26,38.1 16.26,35.81 34.54,35.81 34.54,38.1 50.8,38.1 50.8,0
  pour Route2 (isolate 0.203): 3.81,0 3.81,2.54 0,2.54 0,38.1 16.26,38.1 16.26,35.81 34.54,35.81 34.54,38.1 50.8,38.1 50.8,0
  cutout Top: 3.81,31.75 3.81,26.42 8.89,26.42 8.89,31.75
  cutout Bottom: 3.81,26.42 3.81,31.75 8.89,31.75 8.89,26.42
  cutout Route2: 45.72,31.75 46.99,31.75 46.99,26.67 41.91,26.67 41.91,31.75 43.18,31.75 43.18,31.62 42.04,31.62 42.04,26.8 46.86,26.8 46.86,31.62 45.72,31.62
  cutout Bottom: 41.91,26.67 41.91,31.75 46.99,31.75 46.99,26.67
  cutout Top: 41.91,31.75 41.91,26.67 46.99,26.67 46.99,31.75
  cutout Route2: 5.08,31.75 3.81,31.75 3.81,26.42 8.89,26.42 8.89,31.75 7.62,31.75 7.62,31.62 8.76,31.62 8.76,26.54 3.94,26.54 3.94,31.62 5.08,31.62
IMU_INT2  (via drill 0.3)
  Top 0.152: U7.P9 46.1,28.96 46.35,28.7 v46.35,28.32 | v19.94,34.62 19.56,34.62 19.05,34.11 19.05,29.72 v19.43,29.34
  Bottom 0.152: v46.35,28.32 45.82,28.86 45.82,33.23 43.98,35.08 38.49,35.08 38.16,35.4 36.77,35.4 36.44,35.08 31.06,35.08 29.72,33.73 20.83,33.73 v19.94,34.62
  Bottom 0.203: IMU_INT2.1 19.46,29.31 v19.43,29.34
MAG_INT  (via drill 0.3)
  Top 0.152: U8.15 5.35,28.97 5.71,29.34 v5.71,29.72
  Bottom 0.152: v5.71,29.72 5.71,32.33 4.83,33.22 3.59,33.22 3.33,32.97 3.33,26.26 4.6,24.99 15.79,24.99 16.37,24.41 19.3,24.41 19.46,24.56 MAG_INT.1
N$1
  Top 0.152: J1.B5 27.15,7.08 27.3,7.24 31.36,7.24 R1.2
N$2
  Top 0.152: J1.A5 24.15,7.09 24,7.24 19.44,7.24 R2.2
N$4
  Top 0.152: Q1.2 R5.1
N$5
  Top 0.152: Q1.5 R4.1
N$6  (via drill 0.3)
  Top 0.152: R6.1 17.78,5.72 v17.78,4.7
  Bottom 0.152: STAT.2 15.73,1.38 16.13,1.78 17.02,1.78 17.78,2.54 v17.78,4.7
N$7  (via drill 0.3)
  Top 0.152: D2.DO 37.73,3.17 v37.72,3.17
  Bottom 0.152: TP1.1 37.08,2.54 v37.72,3.17
N$8  (via drill 0.3)
  Top 0.152: v9.4,1.14 9.4,1.39 D3.A
  Bottom 0.152: CHG.1 9.64,1.38 v9.4,1.14
N$9
  Top 0.152: R8.1 15.37,5.85 14.22,4.7 12.19,4.7 11.81,4.32 11.81,2.04 D3.C
N$10  (via drill 0.3)
  Top 0.152: v7.11,15.88 7.05,15.81 U5.1 | v11.81,5.08 14.11,5.08 15.88,6.85 R8.2
  Bottom 0.152: v7.11,15.88 7.11,15.24 7.62,14.73 7.62,7.62 8.89,6.35 | v11.81,5.08 10.16,5.08 8.89,6.35 | VIN1.1 8.89,6.35
N$11
  Top 0.152: U5.5 6.57,17.18 5.59,18.16 R7.2
N$12  (via drill 0.3)
  Top 0.152: v41.27,1.4 41.23,1.35 D2.DI
  Bottom 0.152: RGB.1 41.26,1.38 v41.27,1.4
N$13  (via drill 0.3)
  Top 0.152: D1.A 13.03,3.12 v13.78,3.12
  Bottom 0.152: v13.78,3.12 13.09,2.43 STAT.1
N$16  (via drill 0.3)
  Top 0.152: R16.1 v35.69,15.24
  Bottom 0.152: v35.69,15.24 35.92,15.01 I2C.1
N$17  (via drill 0.3)
  Top 0.152: R19.2 36.46,13.47 v35.69,12.7
  Bottom 0.152: v35.69,12.7 35.92,12.93 I2C.3
PWREN  (via drill 0.3)
  Top 0.152: U10.12 42.41,14.47 v42.55,14.61 | U9.13 13.7,13.46 | 13.7,13.46 13.7,12.71 v13.69,12.7 | R15.2 13.71,13.47 13.7,13.46 | v12.22,12.7 12.22,14.12 U9.10 | U9.5 12.2,16.88 v11.94,17.14 11.7,16.91 U9.6 | U3.3 43.37,22.54 v43.69,22.86 | v41.15,19.68 v43.66,19.68 | v38.86,12.7 38.86,13.34 39,13.47 U10.5
  Bottom 0.152: v42.55,14.61 42.04,14.1 | 42.04,14.1 40.64,12.7 v38.86,12.7 | v12.22,12.7 v13.69,12.7 13.69,15.39 13.27,15.81 | 13.27,15.81 v11.94,17.14 11.94,18.2 12.5,18.77 12.9,18.77 13.1,18.57 16.99,18.57 18.57,20.15 18.57,20.9 18.88,21.21 26.81,21.21 28.97,19.05 35.94,19.05 36.58,19.68 v41.15,19.68 | v43.69,22.86 43.5,22.67 43.5,19.68 | 43.5,19.68 43.5,13.77 43.22,13.49 42.64,13.49 42.04,14.1 | PWREN.1 13.27,15.81 | v43.66,19.68 43.5,19.68
QWIIC_SCL  (via drill 0.3)
  Top 0.152: J5.4 48.51,12.95 J4.4 43.31,12.95 42.79,13.47 U10.10 | J10.4 47.22,6.12 47.12,6.22 v47.12,7.24
  Bottom 0.152: v47.12,7.24 47.6,7.72 47.6,12.04 J5.4
QWIIC_SDA  (via drill 0.3)
  Top 0.152: J5.3 48.26,11.43 47.74,11.95 J4.3 45.58,11.95 v45.09,12.45 | J10.3 46.22,6.04 46.04,6.22 v46.04,7.24 | U10.3 38.87,14.47 v38.73,14.61
  Bottom 0.152: v46.04,7.24 46.04,6.73 46.42,6.35 47.37,6.35 47.88,6.86 47.88,9.78 J5.3 | v38.73,14.61 39.24,14.1 39.24,13.46 39.1,13.32 38.67,13.32 38.35,13 38.35,12.53 38.82,12.06 44.7,12.06 v45.09,12.45
SD_CMD  (via drill 0.3)
  Top 0.152: U9.9 11.7,13.48 11.43,13.21 v11.3,13.21 | R10.1 33.66,12.95 32.52,12.95 31.11,11.55 v31.11,11.2
  Bottom 0.152: v11.3,13.21 11.3,12.54 11.9,11.94 14.88,11.94 15.62,12.69 15.62,14.61 20.67,19.66 24.41,19.66 24.65,19.42 24.65,14.87 J3.3 24.4,12.43 25.25,11.59 30.73,11.59 v31.11,11.2
SD_DAT0  (via drill 0.3)
  Top 0.152: U9.2 13.7,17.34 v13.74,17.38 | R11.1 33.79,14.6 v33.78,14.61
  Bottom 0.152: v13.74,17.38 14.09,17.73 15.23,17.73 15.72,17.24 16.45,17.24 20.14,20.93 26.7,20.93 28.8,18.83 28.8,16.76 | 28.8,16.76 J3.7 | v33.78,14.61 33.78,15.28 32.28,16.79 28.82,16.79 28.8,16.76
SD_DAT2  (via drill 0.3)
  Top 0.152: U9.3 v13.2,17.8 v13.21,17.81 | v19.05,20.7 v22.1,17.65 | R13.1 32,11.3 31.43,10.72 30.68,10.72 30.38,11.02 24.78,11.02 22.89,12.91 v22.82,12.91
  Bottom 0.152: v13.21,17.81 13.41,18.01 15.35,18.01 15.84,17.52 16.34,17.52 19.05,20.23 v19.05,20.7 | v22.1,17.65 22.2,17.55 J3.1 22.2,13.52 22.8,12.91 v22.82,12.91
SHIELD  (via drill 0.3)
  Route2 0.305: J1.SHLD1 21.08,5.18 20.57,4.66 20.57,3.21 21.08,2.7 J1.SHLD3 J1.SHLD4 29.72,2.7 30.23,3.21 30.23,4.66 29.72,5.17 J1.SHLD2 32.87,5.82 v34.16,7.11
  Bottom 0.305: v34.16,7.11 SHLD.2
V_BATT
  Top 0.305: U4.2 4.7,13.97 | U4.3 5.2,13.97
  Top 0.406: 4.2,13.97 4.19,13.97 4.08,13.86 | 4.7,13.97
  Top 0.508: 4.19,13.97 3.05,13.97 | 3.05,13.97 J7.1 | 4.2,13.97 4.7,13.97 5.2,13.97 | J2.2 4.08,13.86 | 4.7,13.97 5.34,13.97 5.85,13.46 8.38,13.46 8.95,14.03 U5.3 9.49,14.57 9.91,14.99 9.91,18.53 C11.1 C30.1 9.39,20.52 9.02,20.89 8.61,20.89 8.26,21.25 D4.A | C13.1 3.05,13.97
V_USB  (via drill 0.3)
  Top 0.406: v23.5,4.45 23.5,5.33 22.95,5.88 J1.VBUS1 | v27.3,4.45 27.3,5.33 27.85,5.88 J1.VBUS2
  Top 0.508: v3.17,22.86 3.17,23.24 3.29,23.36 D5.A 3.29,25.03 v3.17,25.15 | v19.56,11.18 19.22,11.52 D7.2 17.23,11.52 v16.89,11.18
  Route15 0.711: v3.17,25.15 v3.17,22.86 3.17,14.61 3.81,13.97 7.62,13.97 8.89,12.7 8.89,11.94 9.65,11.18 v16.89,11.18 v19.56,11.18 21.2,11.18 21.48,11.46 23.08,11.46 24.13,10.41 24.13,7.62 23.5,6.99 v23.5,4.45 v27.3,4.45
VIN  (via drill 0.3)
  Top 0.152: U5.4 8.95,15.94 v8.89,15.88 | v9.4,2.54 9.78,2.92 9.78,5.81 v10.03,6.07
  Top 0.508: C10.1 v46.48,20.32 45.47,20.32 | 45.47,20.32 v44.45,20.32 C9.1 43.95,21.09 43.5,20.64 U3.1 | C8.1 45.47,20.32 | v12.7,22.48 12.64,22.54 U6.1 | U6.3 12.64,20.64 v12.7,20.7 | C17.1 11.4,19.98 U6.3 | U5.4 8.1,17.18 7.87,17.4 7.87,17.91 7.24,18.54 C12.1 6.47,19.06 5.59,19.93 D6.C 5.58,20.34 C29.1 v5.58,23 5.58,24.11 D5.C 6.73,24.13 6.86,24 8.25,24 D4.C 9.53,24.01 9.79,24.27 C16.1 10.79,23.75 11.4,23.14 U6.1 | U6.1 10.22,22.54 9.69,22.01 9.69,21.3 10.35,20.64 U6.3
  Route15 0.508: v46.48,20.32 v44.45,20.32 44.07,20.32 43.69,20.7 40.77,20.7 39.5,21.97 36.45,21.97 34.29,24.13 27.43,24.13 26.92,23.62 26.92,22.23 26.54,21.84 21.72,21.84 21.08,22.48 v12.7,22.48 12.19,22.48 11.94,22.23 11.94,20.95 12.19,20.7 v12.7,20.7
  Bottom 0.152: v8.89,15.88 8.89,12.7 7.9,11.71 7.9,7.74 9.57,6.07 v10.03,6.07 | v9.4,2.54 10.68,2.54 CHG.2 | VIN.1 5.72,22.86 v5.58,23

## Text on the board
Route2: 2
Route15: 3
Bottom: v12
Measures: Dimensions / In Inches
tDocu: 4-Layers / 1.6mm Thickness / 1oz Copper / Lead-Free HASL Finish / Red Solder Resist / White Silkscreen / Material: TG155 / Stackup: JLC7628 | Paul Clark | Revised by: | Alex Brudner